# EAGLE schematic lm2676 (EAGLE 6.6.0)
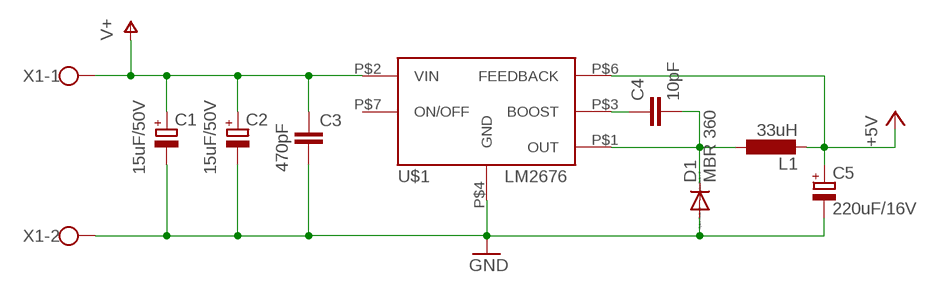
[diagram p0: schematic, sheet 1]

## Parts
C1  15uF/50V  CPOL-EUE2-5  [E2-5]
C2  15uF/50V  CPOL-EUE2-5  [E2-5]
C3  470pF  C-EU025-025X050  [C025-025X050]
C4  10pF  C-EU025-025X050  [C025-025X050]
C5  220uF/16V  CPOL-EUE2.5-6  [E2,5-6]
D1  MBR 360  1N5400  [DO201-15]
L1  33uH  L-EUTFI0510  [TFI0510]
U$1  LM2676  [LM2676]
X1  W237-102  [W237-102]

## Nets
+5V: C5.+ L1.2 U$1.P$6(FEEDBACK)
GND: C1.- C2.- C3.2 C5.- D1.A U$1.P$4(GND) X1.2
N$3: C4.1 U$1.P$3(BOOST)
N$4: C4.2 D1.C L1.1 U$1.P$1(OUT)
V+: C1.+ C2.+ C3.1 U$1.P$2(VIN) X1.1
Unconnected: U$1.P$7(ON/OFF)

## Library data of the parts
C1 C2 C5 = rcl:CPOL-EU: POLARIZED CAPACITOR, European symbol
C3 C4 = rcl:C-EU: CAPACITOR, European symbol
D1 = diode:1N5400: DIODE standard rectifier, 3 A, 50 V (Motorola)
L1 = rcl:L-EU: INDUCTOR, European symbol
U$1 = Webmaster442:LM2676: LM2676 SIMPLE SWITCHER High Efficiency 3A Step-Down Voltage Regulator
X1 = con-wago-500:W237-102: WAGO SCREW CLAMP; MPN: 237-102; OC_FARNELL: unknown; OC_NEWARK: 70K9898